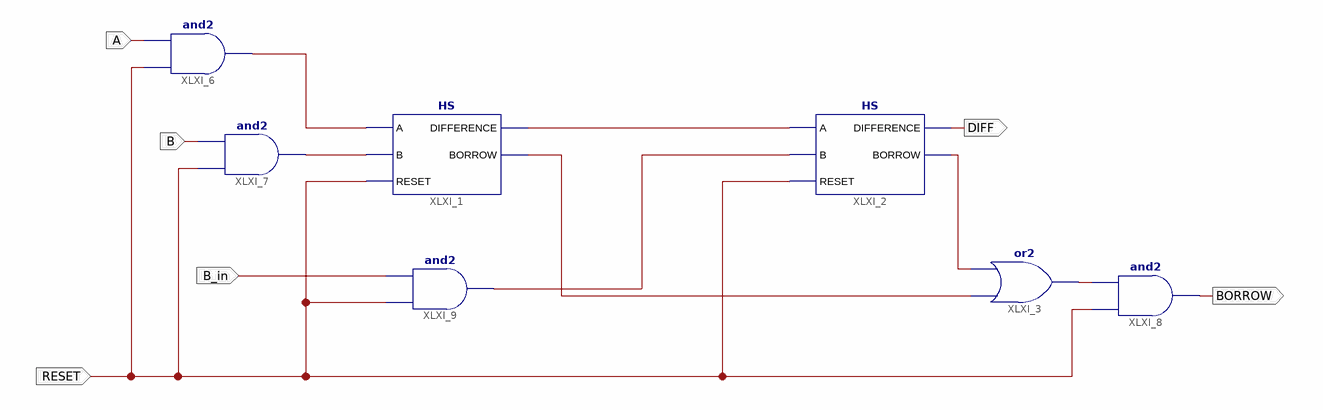
[diagram p0: schematic sheet 1]
// Xilinx ISE schematic Full_Subtracter.sch (spartan6) as structural Verilog: 7 symbols, 6 ports
module Full_Subtracter (
  input  B_in,
  input  RESET,
  input  A,
  input  B,
  output DIFF,
  output BORROW
);

  wire XLXN_1, XLXN_2, XLXN_3, XLXN_4, XLXN_15, XLXN_16, XLXN_17;

  HS XLXI_1 (.A(XLXN_2), .B(XLXN_3), .BORROW(XLXN_17), .DIFFERENCE(XLXN_1), .RESET(RESET));
  HS XLXI_2 (.A(XLXN_1), .B(XLXN_15), .BORROW(XLXN_16), .DIFFERENCE(DIFF), .RESET(RESET));
  or XLXI_3 (XLXN_4, XLXN_17, XLXN_16);
  and XLXI_6 (XLXN_2, RESET, A);
  and XLXI_7 (XLXN_3, RESET, B);
  and XLXI_8 (BORROW, RESET, XLXN_4);
  and XLXI_9 (XLXN_15, RESET, B_in);
endmodule
